# EAGLE design water_level_aq (EAGLE 9.6.2)
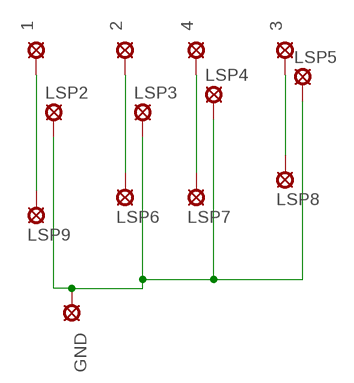
[diagram p0: schematic, sheet 1]

## Parts
1  SE13  [SE13]
2  SE13  [SE13]
3  SE13  [SE13]
4  SE13  [SE13]
GND  SE13  [SE13]
LSP2  MCS10B  [MCS10B]
LSP3  MCS10B  [MCS10B]
LSP4  MCS10B  [MCS10B]
LSP5  MCS10B  [MCS10B]
LSP6  MCS10B  [MCS10B]
LSP7  MCS10B  [MCS10B]
LSP8  MCS10B  [MCS10B]
LSP9  MCS10B  [MCS10B]

## Nets
N$1: 1.MP LSP9.MP
N$2: GND.MP LSP2.MP LSP3.MP LSP4.MP LSP5.MP
N$3: 2.MP LSP6.MP
N$4: 4.MP LSP7.MP
N$5: 3.MP LSP8.MP

## Library data of the parts
1-4 GND = solpad:SE13: SOLDER PAD E1542, drill 1,3mm, distributor Buerklin, 07F815
LSP2-LSP9 = solpad:MCS10B: SOLDER PAD MC S1, distributor Buerklin, 15F505

## Board
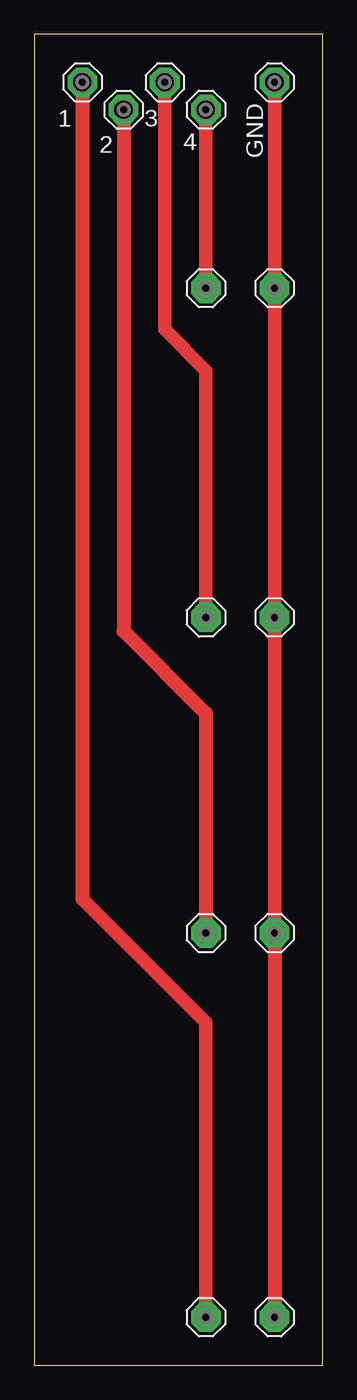
[diagram p1: board, top side]

Size 21 x 97 mm. Coordinates in mm from the lower left corner, seen from the top.
Outline: 0,0 21,0 21,97 0,97 0,0
Copper layers (1*16): Top 0.035559375mm / dielectric 1.6mm / Bottom 0.035559375mm
Design rules "jlcpcb2layer": minimum track width 5mil, minimum drill 12mil, track to track 5mil, track to pad 5mil, pad to pad 5mil, via to via 5mil, smd to smd 5mil, copper to edge 8mil, drill to drill 6mil, minimum pad ring 5mil, minimum via ring 3mil, stop-mask expansion 2.5mil, vias tented up to drill 0mil, thermal gap 10mil

### Footprints (pad centres in the part's own frame; a part is rotated, then mirrored left to right if it is on the bottom)
SE13 = drill 1.321 pad 2.159 octagon: MP 0,0
MCS10B = drill 1.016 pad 2.159 octagon: MP 0,0

### Placement (x,y rotation side)
1  3.5,93.5 0 top
2  6.5,91.5 0 top
3  9.5,93.5 0 top
4  12.5,91.5 0 top
GND  17.5,93.5 0 top
LSP2  17.5,3.5 0 top
LSP3  17.5,78.5 0 top
LSP4  17.5,54.5 0 top
LSP5  17.5,31.5 0 top
LSP6  12.5,31.5 0 top
LSP7  12.5,78.5 0 top
LSP8  12.5,54.5 0 top
LSP9  12.5,3.5 0 top

### Tracks (layer width: path | path; a pad name or v marks a point on that pad's centre or on a via)
N$1
  Top 1: LSP9.MP 12.5,24.98 3.5,33.98
  Top 1.016: 1.MP 3.5,33.98
N$2
  Top 1: LSP5.MP LSP4.MP LSP3.MP GND.MP
  Top 1.016: LSP5.MP LSP2.MP
N$3
  Top 1.016: 2.MP 6.5,53.5 12.5,47.5 LSP6.MP
N$4
  Top 1: LSP7.MP 4.MP
N$5
  Top 1: 3.MP 9.5,75.5 12.5,72.5 LSP8.MP